# EAGLE design AT24-Timer (EAGLE 8.2.2)
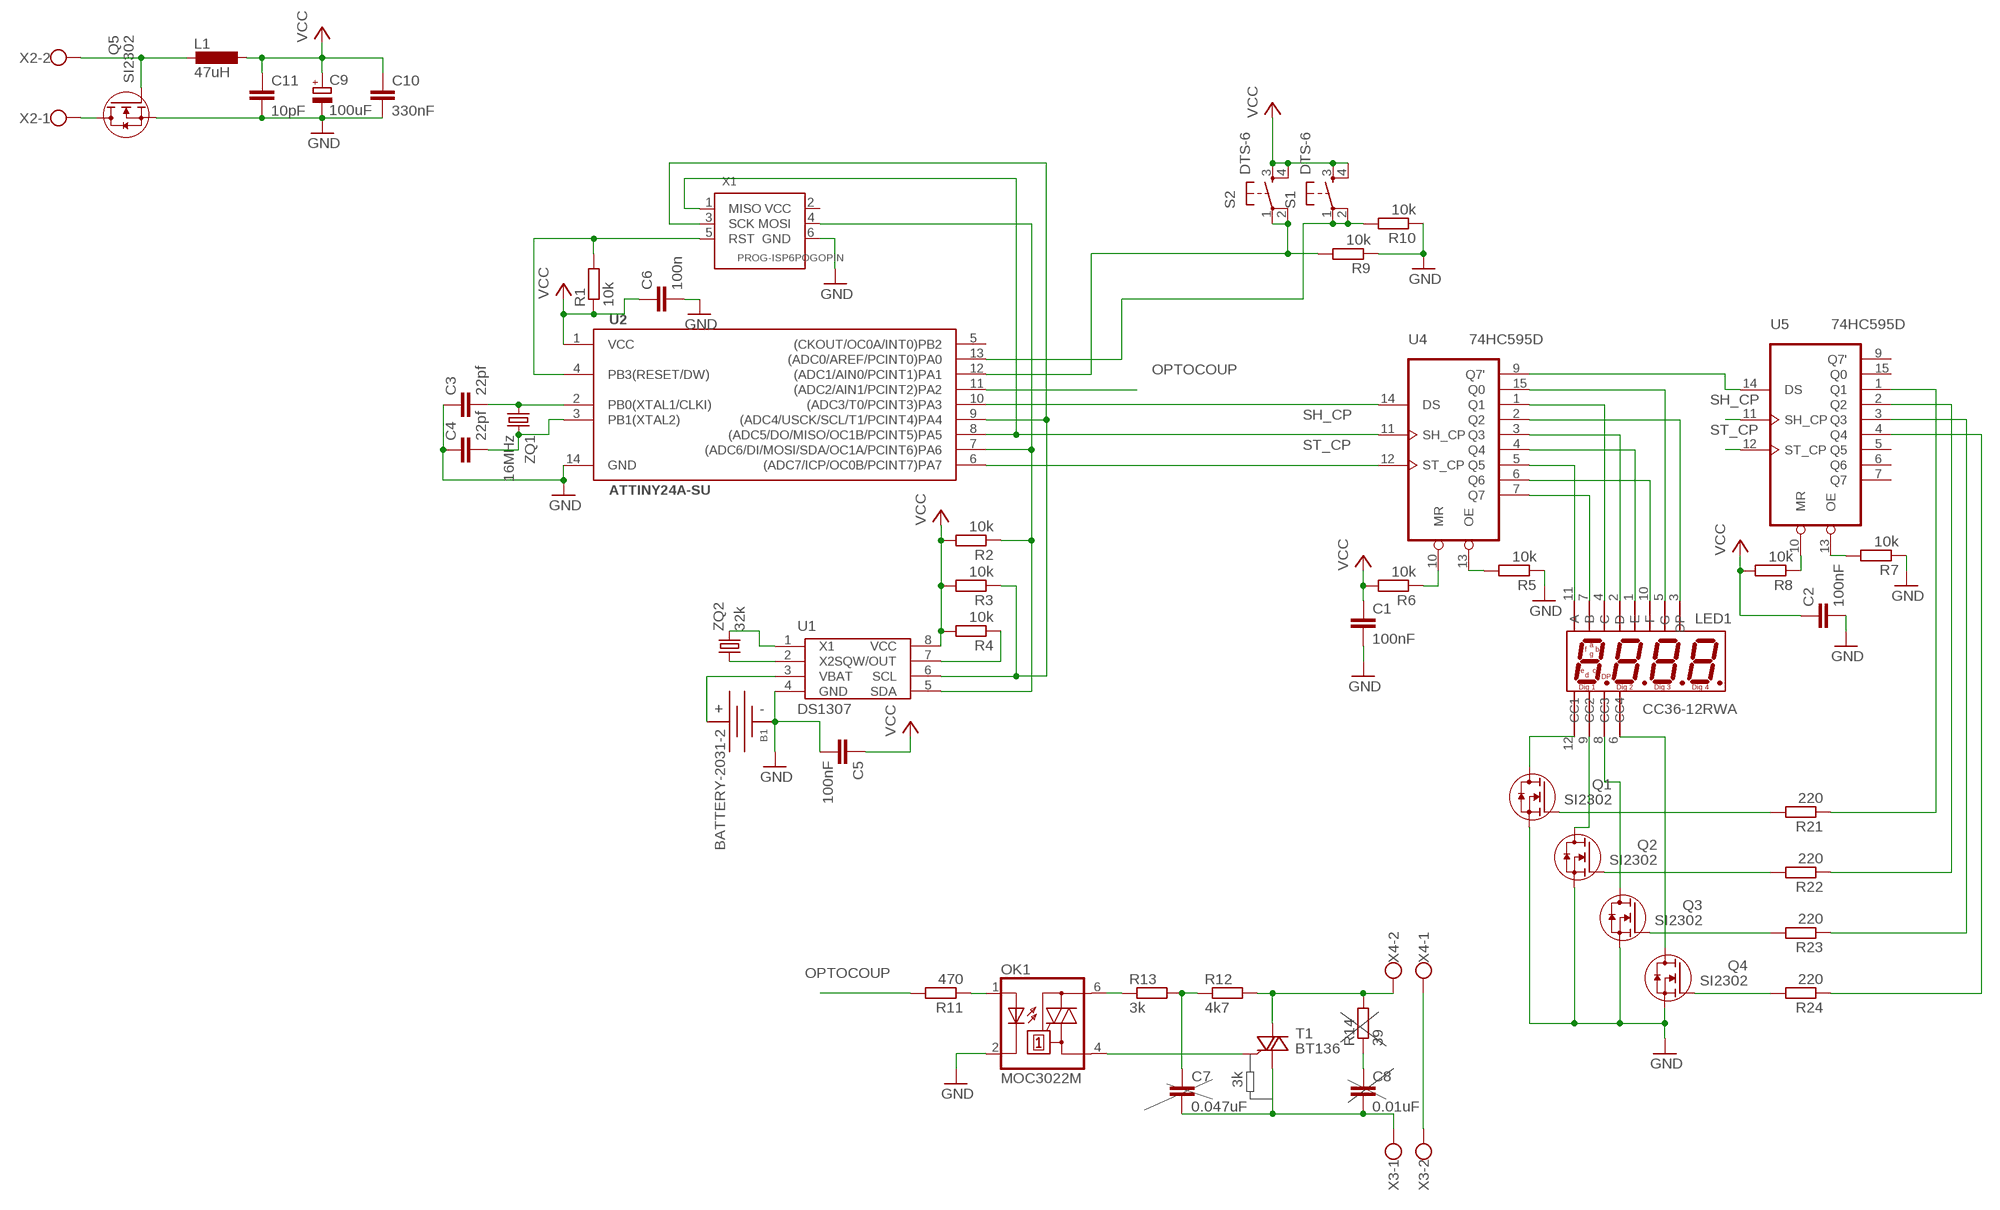
[diagram p0: schematic, sheet 1]

## Parts
B1  BATTERY-2031-2  [BTH2032-2]
C1  100nF  C-EUC0603  [C0603]
C2  100nF  C-EUC0603  [C0603]
C3  22pf  C-EUC0603  [C0603]
C4  22pf  C-EUC0603  [C0603]
C5  100nF  C-EUC0603  [C0603]
C6  100n  C-EUC0603  [C0603]
C7  0.047uF  C-EU150-054X183  [C150-054X183]
C8  0.01uF  C-EU102-043X133  [C102-043X133]
C9  100uF  CPOL-EUE2-5  [E2-5]
C10  330nF  C-EUC0805  [C0805]
C11  10pF  C-EUC0805  [C0805]
L1  47uH  L-EU0204V  [0204V]
LED1  CC36-12RWA  [7SEG_4DIG]
OK1  MOC3022M  [DIL06]
Q1  SI2302  [SOT-23-GSD]
Q2  SI2302  [SOT-23-GSD]
Q3  SI2302  [SOT-23-GSD]
Q4  SI2302  [SOT-23-GSD]
Q5  SI2302  [SOT-23-GSD]
R1  10k  R-EU_R0805  [R0805]
R2  10k  R-EU_R0805  [R0805]
R3  10k  R-EU_R0805  [R0805]
R4  10k  R-EU_R0805  [R0805]
R5  10k  R-EU_R0805  [R0805]
R6  10k  R-EU_R0805  [R0805]
R7  10k  R-EU_R0805  [R0805]
R8  10k  R-EU_R0805  [R0805]
R9  10k  R-EU_R0805  [R0805]
R10  10k  R-EU_R0805  [R0805]
R11  470  R-EU_R0805  [R0805]
R12  4k7  R-EU_0207/7  [0207/7]
R13  3k  R-EU_0207/7  [0207/7]
R14  39  R-EU_0207/7  [0207/7]
R21  220  R-EU_R0805  [R0805]
R22  220  R-EU_R0805  [R0805]
R23  220  R-EU_R0805  [R0805]
R24  220  R-EU_R0805  [R0805]
S1  DTS-6  [DTS-6]
S2  DTS-6  [DTS-6]
T1  BT136  [TO220AB]
U1  DS1307  [SOP08]
U2  ATTINY24A-SU  [SO14]
U4  74HC595D  [SO16]
U5  74HC595D  [SO16]
X1  PROG-ISP6POGOPIN  [PROG_POGOPIN]
X2  W237-102  [W237-102]
X3  W237-102  [W237-102]
X4  W237-102  [W237-102]
ZQ1  16MHz  CRYSTALHC49S  [HC49/S]
ZQ2  32k  CRYSTALTC38H  [TC38H]

## Nets
GND: B1.- C1.2 C2.2 C3.1 C4.1 C5.2 C6.2 C9.- C10.2 C11.2 OK1.2(C) Q1.S Q2.S Q3.S Q4.S Q5.S R5.1 R7.1 R9.1 R10.1 U1.4(GND) U2.14(GND) X1.6(GND)
N$1: X3.2 X4.1
N$2: Q5.D X2.1
N$3: R2.1 U1.5(SDA) U2.7((ADC6/DI/MOSI/SDA/OC1A/PCINT6)PA6) X1.4(MOSI)
N$4: R3.1 U1.6(SCL) U2.9((ADC4/USCK/SCL/T1/PCINT4)PA4) X1.3(SCK)
N$5: R1.2 U2.4(PB3(RESET/DW)) X1.5(RST)
N$6: R10.2 S1.1 S1.2 U2.13((ADC0/AREF/PCINT0)PA0)
N$7: C3.2 U2.2(PB0(XTAL1/CLKI)) ZQ1.1
N$8: C4.2 U2.3(PB1(XTAL2)) ZQ1.2
N$9: R6.1 U4.10(MR)
N$10: R9.2 S2.1 S2.2 U2.12((ADC1/AIN0/PCINT1)PA1)
N$11: U1.2(X2) ZQ2.1
N$12: C8.1 R14.1
N$13: C7.2 C8.2 T1.1(A1) X3.1
N$14: R12.2 R14.2 T1.2(A2) X4.2
N$17: OK1.4(A1) T1.3(G)
N$18: C7.1 R12.1 R13.2
N$19: OK1.6(A2) R13.1
N$20: R5.2 U4.13(OE)
N$21: OK1.1(A) R11.1
N$22: R8.1 U5.10(MR)
N$23: R4.1 U1.7(SQW/OUT)
N$24: U1.1(X1) ZQ2.2
N$25: R7.2 U5.13(OE)
N$26: B1.+ U1.3(VBAT)
N$27: U2.10((ADC3/T0/PCINT3)PA3) U4.14(DS)
N$28: LED1.11(A) U4.5(Q5)
N$29: LED1.7(B) U4.7(Q7)
N$30: U4.9(Q7') U5.14(DS)
N$31: LED1.4(C) U4.1(Q1)
N$32: LED1.2(D) U4.3(Q3)
N$33: LED1.1(E) U4.4(Q4)
N$34: LED1.10(F) U4.6(Q6)
N$35: LED1.5(G) U4.15(Q0)
N$36: LED1.3(DP) U4.2(Q2)
N$37: LED1.12(CC1) Q1.D
N$38: LED1.9(CC2) Q2.D
N$39: LED1.8(CC3) Q3.D
N$40: LED1.6(CC4) Q4.D
N$41: R21.1 U5.1(Q1)
N$42: R22.1 U5.2(Q2)
N$43: R23.1 U5.3(Q3)
N$44: R24.1 U5.4(Q4)
N$49: L1.2 Q5.G X2.2
N$65: Q4.G R24.2
N$66: Q3.G R23.2
N$67: Q2.G R22.2
N$68: Q1.G R21.2
OPTOCOUP: R11.2 U2.11((ADC2/AIN1/PCINT2)PA2)
SH_CP: U2.8((ADC5/DO/MISO/OC1B/PCINT5)PA5) U4.11(SH_CP) U5.11(SH_CP) X1.1(MISO)
ST_CP: U2.6((ADC7/ICP/OC0B/PCINT7)PA7) U4.12(ST_CP) U5.12(ST_CP)
VCC: C1.1 C2.1 C5.1 C6.1 C9.+ C10.1 C11.1 L1.1 R1.1 R2.2 R3.2 R4.2 R6.2 R8.2 S1.3 S1.4 S2.3 S2.4 U1.8(VCC) U2.1(VCC)
Unconnected: U2.5((CKOUT/OC0A/INT0)PB2) U5.5(Q5) U5.6(Q6) U5.7(Q7) U5.9(Q7') U5.15(Q0) X1.2(VCC)

## Notes on the sheet
- 3k

## Power pins joined to a net without a drawn wire
GND: U4.8(GND) U5.8(GND)
VCC: U4.16(VCC) U5.16(VCC)

## Library data of the parts
B1 = usb:BATTERY
C1-C8 C10 C11 = rcl:C-EU: CAPACITOR, European symbol
C9 = rcl:CPOL-EU: POLARIZED CAPACITOR, European symbol
L1 = rcl:L-EU: INDUCTOR, European symbol
LED1 = usb:CC36-12RWA: 7 Segment 4 Digit 0.36inch Common Catode
OK1 = optocoupler:MOC30*M: RANDOM-PHASE OPTOISOLATORS TRIAC DRIVER OUTPUT Source: http://www.fairchildsemi.com MOC3020-M.pdf; MF: FAIRCHILD SEMICONDUCTOR; MPN: MOC3022-M; OC_FARNELL: 1021086; OC_NEWARK: 58K1956
Q1-Q5 = usb:SI2302: N-канальный полевик
R1-R14 R21-R24 = rcl:R-EU_: RESISTOR, European symbol
S1 S2 = switch-tact:DTS-6
T1 = triac:BT136: Triac BT136 series E sensitive gate Source: http://www.nxp.com/acrobat_download/datasheets/BT136_SERIES_E_2.pdf
U1 = usb:DS1307: Real-Time Clock DS1307
U2 = usb:ATTINY24A: ATTiny24A ATTiny44A ATTiny84A
U4 U5 = 74xx-eu:74*595: 8-bit SHIFT REGISTER, output latch
X1 = usb:PROG-ISP
X2-X4 = con-wago-500:W237-102: WAGO SCREW CLAMP; MPN: 237-102; OC_FARNELL: unknown; OC_NEWARK: 70K9898
ZQ1 = crystal:CRYSTAL: CRYSTAL; OC_FARNELL: 1667008; OC_NEWARK: unknown
ZQ2 = crystal:CRYSTAL: CRYSTAL; OC_FARNELL: unknown; OC_NEWARK: unknown

## Board
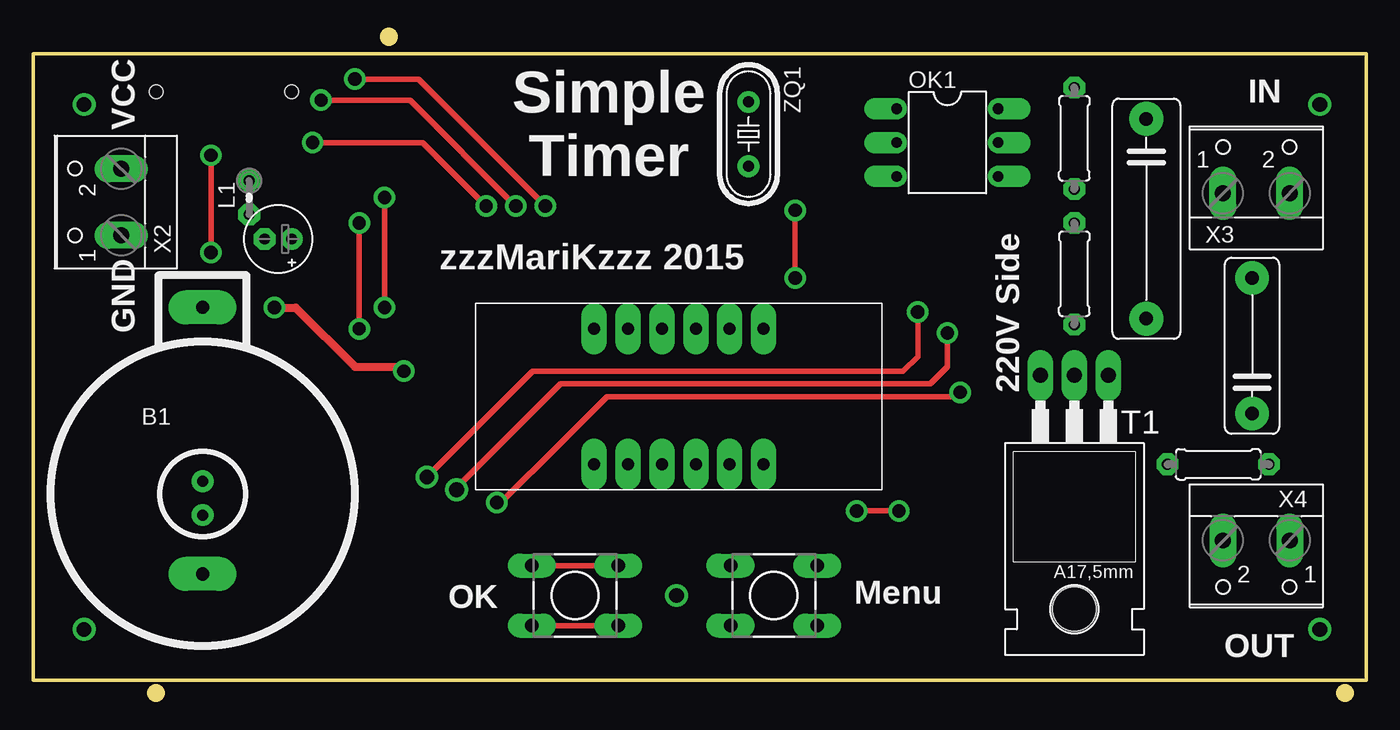
[diagram p1: board, top side]
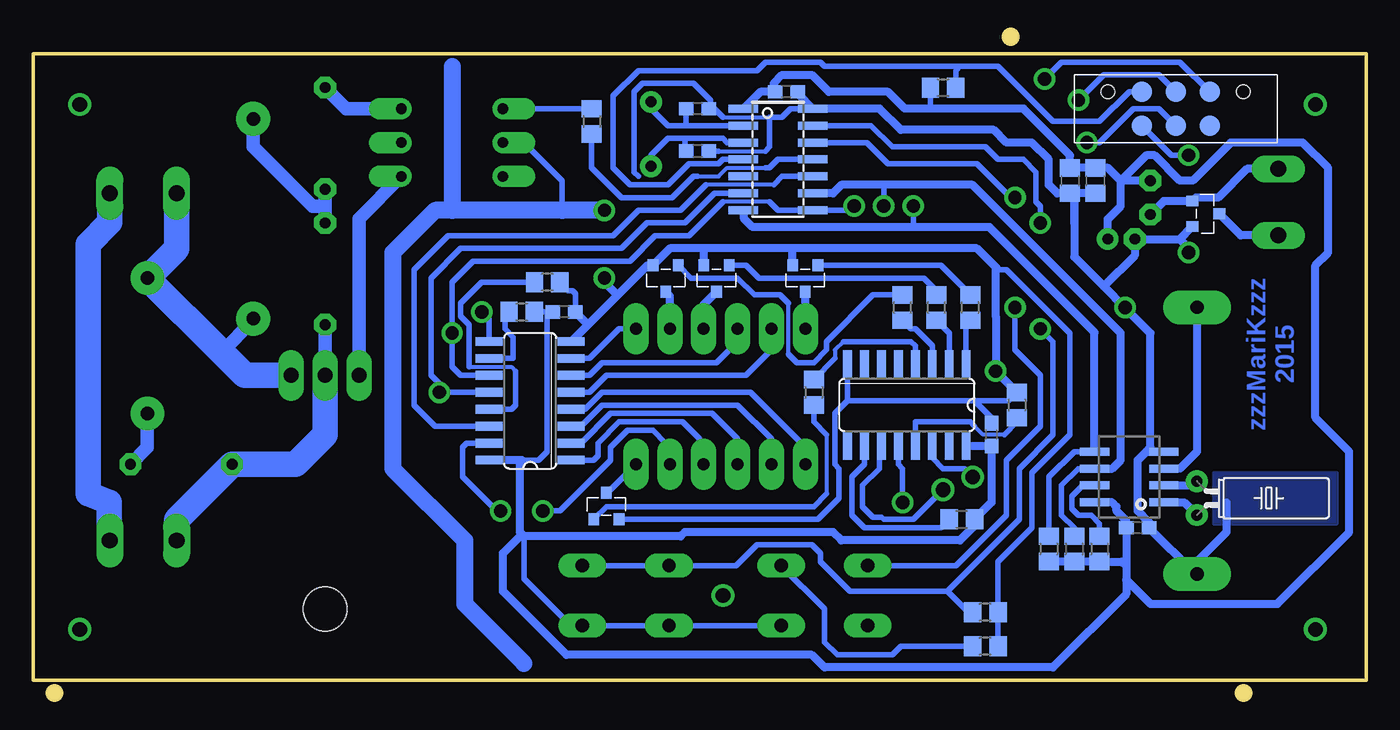
[diagram p2: board, bottom side, seen from below]

Size 100 x 49.72 mm. Coordinates in mm from the lower left corner, seen from the top.
Outline: 0,1.21 100,1.21 100,48.21 0,48.21 0,1.21
Outline: circle at 26.67,49.47 radius 0.25
Outline: circle at 9.21,0.25 radius 0.25
Outline: circle at 98.42,0.25 radius 0.25
Copper layers (1*16): Top 0.035mm / dielectric 1.5mm / Bottom 0.035mm
Design rules "default *": minimum track width 12mil, minimum drill 20mil, track to track 12mil, track to pad 12mil, pad to pad 12mil, via to via 12mil, smd to smd 8mil, copper to edge 20mil, drill to drill 8mil, minimum pad ring 16mil, minimum via ring 12mil, stop-mask expansion 4mil, vias tented up to drill 0mil, thermal gap 20mil
Holes 0.6 mm at 26.67,49.47 9.21,0.25 98.42,0.25

### Footprints (pad centres in the part's own frame; a part is rotated, then mirrored left to right if it is on the bottom)
BTH2032-2 = drill 1 pad 2.54 long: + 0,-14; - 0,6
C0603 = smd 1.1 x 1: 1 -0.85,0; 2 0.85,0
C150-054X183 = drill 1.016 pad 2.54: 1 -7.493,0; 2 7.493,0
C102-043X133 = drill 1.016 pad 2.54: 1 -5.08,0; 2 5.08,0
E2-5 = drill 0.813 pad 1.27: + -1.016,0 | drill 0.813 pad 1.27 octagon: - 1.016,0
C0805 = smd 1.3 x 1.5: 1 -0.95,0; 2 0.95,0
0204V = drill 0.813 octagon: 1 -1.27,0; 2 1.27,0
7SEG_4DIG = drill 0.9 pad 1.93 long: 1 -6.35,-5.08; 2 -3.81,-5.08; 3 -1.27,-5.08; 4 1.27,-5.08; 5 3.81,-5.08; 6 6.35,-5.08; 7 6.35,5.08; 8 3.81,5.08; 9 1.27,5.08; 10 -1.27,5.08; 11 -3.81,5.08; 12 -6.35,5.08
DIL06 = drill 0.813 offset: 1 -2.54,-3.81; 2 0,-3.81; 3 2.54,-3.81; 4 2.54,3.81; 5 0,3.81; 6 -2.54,3.81
SOT-23-GSD = smd 0.8 x 0.9: D 0,2; G -0.95,0; S 0.95,0
R0805 = smd 1.3 x 1.5: 1 -0.95,0; 2 0.95,0
0207/7 = drill 0.813 octagon: 1 -3.81,0; 2 3.81,0
DTS-6 = drill 1 long: 1 -3.25,2.25; 2 3.25,2.25; 3 -3.25,-2.25; 4 3.25,-2.25
TO220AB = drill 1.118 long: 1 -2.54,-6.35; 2 0,-6.35; 3 2.54,-6.35 | hole 3.302: 0,11.176
SOP08 = smd 0.6 x 2.2: 1 -1.905,-2.6; 2 -0.635,-2.6; 3 0.635,-2.6; 4 1.905,-2.6; 5 1.905,2.6; 6 0.635,2.6; 7 -0.635,2.6; 8 -1.905,2.6
SO14 = smd 0.6 x 2.2: 1 -3.81,-2.6; 2 -2.54,-2.6; 3 -1.27,-2.6; 4 0,-2.6; 5 1.27,-2.6; 6 2.54,-2.6; 7 3.81,-2.6; 8 3.81,2.6; 9 2.54,2.6; 10 1.27,2.6; 11 0,2.6; 12 -1.27,2.6; 13 -2.54,2.6; 14 -3.81,2.6
SO16 = smd 0.66 x 2.032: 1 -4.445,-3.073; 2 -3.175,-3.073; 3 -1.905,-3.073; 4 -0.635,-3.073; 5 0.635,-3.073; 6 1.905,-3.073; 7 3.175,-3.073; 8 4.445,-3.073; 9 4.445,3.073; 10 3.175,3.073; 11 1.905,3.073; 12 0.635,3.073; 13 -0.635,3.073; 14 -1.905,3.073; 15 -3.175,3.073; 16 -4.445,3.073
PROG_POGOPIN = smd 1.524 x 1.524: 1 0,7.62; 2 2.54,7.62; 3 0,5.08; 4 2.54,5.08; 5 0,2.54; 6 2.54,2.54 | hole 1.016: 0,0; 0,10.16
W237-102 = drill 1.194 long: 1 -2.5,-1.27; 2 2.5,-1.27
HC49/S = drill 0.813: 1 -2.413,0; 2 2.413,0
TC38H = drill 0.813: 1 -1.27,0; 2 1.27,0

### Placement (x,y rotation side)
B1  12.7,15.18 180 top
C1  28.11,19.62 90 bottom
C2  60.18,28.83 0 bottom
C3  50.16,44.07 180 bottom
C4  50.16,40.89 180 bottom
C5  17.14,12.64 0 bottom
C6  43.5,45.34 0 bottom
C7  83.5,35.81 270 top
C8  91.44,26.29 90 top
C9  18.38,34.29 180 top
C10  22.23,38.67 270 bottom
C11  20.32,38.67 270 bottom
L1  16.19,37.4 270 top
LED1  48.43,22.48 0 top
OK1  68.58,41.53 270 top
Q1  42.08,32.32 180 bottom
Q2  48.75,32.32 180 bottom
Q3  52.56,32.32 180 bottom
Q4  57.01,13.27 0 bottom
Q5  13.03,36.19 270 bottom
R1  31.75,45.66 0 bottom
R2  23.81,11.05 270 bottom
R3  21.91,11.05 270 bottom
R4  20,11.05 270 bottom
R5  61.45,31.05 180 bottom
R6  63.35,28.83 0 bottom
R7  26.21,21.84 270 bottom
R8  30.34,13.27 0 bottom
R9  28.57,3.75 180 bottom
R10  28.57,6.29 180 bottom
R11  58.1,43.12 270 bottom
R12  78.11,31.69 270 top
R13  78.11,41.85 270 top
R14  88.9,17.4 180 top
R21  29.7,29.15 90 bottom
R22  32.24,29.15 90 bottom
R23  34.78,29.15 90 bottom
R24  41.45,22.8 270 bottom
S1  55.56,7.56 0 top
S2  40.64,7.56 0 top
T1  78.11,17.72 180 top
U1  17.78,16.45 90 bottom
U2  44.13,40.26 270 bottom
U4  62.72,22.16 90 bottom
U5  34.46,21.84 180 bottom
X1  19.37,45.34 270 bottom
X2  5.33,37.06 90 top
X3  91.76,38.99 0 top
X4  91.76,10.41 180 top
ZQ1  53.66,42.16 270 top
ZQ2  12.7,14.86 270 bottom

### Tracks (layer width: path | path; a pad name or v marks a point on that pad's centre or on a via)
GND  (via drill 1)
  Top 0.406: v13.34,40.58 v13.34,33.27 | v57.15,36.45 v57.15,31.37
  Top 0.61: v18.1,29.15 19.68,29.15 24.13,24.7 27.48,24.7 v27.8,24.38
  Bottom 0.305: 48.26,43.43 44.77,43.43 | 48.58,40.89 45.09,40.89
  Bottom 0.406: U5.8 38.91,22.16 | 38.91,22.16 39.86,21.21 39.86,17.4 39.54,17.08 39.54,14.86 41.13,13.27 Q4.S | 59.55,28.83 C2.2 59.33,30.2 59.55,30.42 59.87,30.42 R5.1 | C1.2 28.11,20.89 29.38,22.16 | 29.38,22.16 38.91,22.16 | R7.1 26.84,22.16 29.38,22.16 | C3.1 48.9,44.07 48.26,43.43 | U2.14 43.18,44.07 43.81,43.43 44.77,43.43 44.77,41.21 45.09,40.89 | C4.1 48.58,40.89 | R9.1 R10.1 27.62,10.09 25.08,12.64 25.08,16.76 22.23,19.62 22.23,27.24 26.99,32 27.48,32 27.8,32.32 27.8,28.51 | X1.6 14.61,40.58 v13.34,40.58 | OK1.2 63.18,41.53 60.33,38.67 60.33,36.45
  Bottom 0.61: R7.1 v27.8,24.38 27.8,28.51 27.8,32.18 29.21,33.59 43.18,33.59 | 16.51,18.35 17.14,17.72 17.14,13.91 16.3,13.06 C5.2 12.84,9.18 B1.- 12.7,10.1 10.48,12.32 10.48,14.54 | 16.51,18.35 U1.4 | C6.2 42.65,45.18 U2.14 36.51,44.07 34.92,42.48 27.94,42.48 26.99,41.53 25.08,41.53 23.81,40.26 23.81,38.35 23.18,37.72 C10.2 | 43.18,33.59 49.85,33.59 | 49.85,33.59 52.24,33.59 Q3.S 53.93,32.32 56.18,30.08 | Q1.S 43.03,33.44 43.18,33.59 | 16.51,18.35 16.19,18.67 16.19,27.24 v18.1,29.15 19.68,30.73 | Q2.S 49.7,33.44 49.85,33.59 | 56.18,30.08 58.4,27.85 | 58.4,27.85 U4.8 | 59.55,28.83 59.37,28.83 58.4,27.85 | v57.15,31.37 57.15,31.05 56.18,30.08 | 21.91,35.5 21.91,37.4 C10.2 | C10.2 C11.2 21.91,37.72 21.91,32.96 19.68,30.73 | 19.68,30.73 17.36,33.06 C9.- 13.98,34.29 | 13.98,34.29 Q5.S | v13.34,33.27 13.34,33.65 13.98,34.29
  Bottom 1.27: v57.15,36.45 60.33,36.45 68.58,36.45 | 68.58,36.45 69.85,36.45 73.03,33.27 73.03,17.08 67.63,11.68 67.63,6.92 63.18,2.48 | 68.58,47.24 68.58,36.45
  pour Bottom: 2.22,16.76 2.22,12.95 11.43,12.95 11.43,16.76
N$1
  Bottom 0.406: 94.3,12.04 94.3,11.72 X4.1
  Bottom 1.93: X3.2 94.26,35.54 95.89,33.91 95.89,15.18 94.3,14.54 94.3,12.04
N$2
  Bottom 0.61: X2.1 9.41,34.56 Q5.D
N$3  (via drill 1)
  Top 0.406: v20.95,41.53 29.21,41.53 v33.97,36.77
  Bottom 0.406: R2.1 23.81,16.45 21.91,18.35 U1.5 | X1.4 15.56,44.07 17.46,44.07 20,41.53 v20.95,41.53 | v33.97,36.77 33.97,35.18
  Bottom 0.61: U1.5 20.38,27.3 28.26,35.18 33.97,35.18 46.04,35.18 46.67,35.81 46.67,36.39 U2.7
N$4  (via drill 1)
  Top 0.406: v21.59,44.7 28.26,44.7 v36.2,36.77
  Bottom 0.406: R3.1 21.91,12.64 22.86,13.59 22.86,15.81 21.59,17.08 U1.6 | X1.3 15.56,46.61 19.68,46.61 v21.59,44.7 | v36.2,36.77 36.2,38.35
  Bottom 0.61: U1.6 19.05,17.08 18.41,17.72 18.41,27.24 29.53,38.35 36.2,38.35 39.37,38.35 40.01,37.72 U2.9
N$5
  Bottom 0.406: U2.4 48.26,40.26 48.58,39.94 50.8,39.94 52.39,38.35 55.24,38.35 56.52,39.62 56.52,45.02 54.61,46.93 45.72,46.93 45.09,47.56 40.96,47.56 40.64,47.24 30.48,47.24 | 30.48,47.24 27.62,47.24 23.5,43.12 20,43.12 17.78,45.34 X1.5 | R1.2 30.8,46.92 30.48,47.24
N$6  (via drill 1)
  Top 0.406: v24.45,35.5 v24.45,27.56
  Bottom 0.406: 31.43,7.87 38.73,7.87 40.96,10.1 40.96,10.73 41.59,11.37 45.72,11.37 47.28,9.81 S1.1 S1.2 | 31.43,7.87 26.04,13.27 26.04,17.08 23.5,19.62 23.5,26.61 v24.45,27.56 | R10.2 29.84,6.29 31.43,7.87 | U2.13 37.15,42.8 35.56,41.21 28.57,41.21 27.62,40.26 25.72,40.26 24.77,39.31 24.77,37.08 24.45,36.77 v24.45,35.5
N$7
  Bottom 0.406: ZQ1.1 53.66,44.07 52.39,42.8 51.12,42.8 | 51.12,42.8 U2.2 | C3.2 51.02,42.9 51.12,42.8
N$8
  Bottom 0.406: ZQ1.2 53.66,40.58 52.39,41.85 51.12,41.85 | 51.12,41.85 48.26,41.85 47.94,41.53 U2.3 | C4.2 51.12,40.89 51.12,41.85
N$9
  Bottom 0.406: U4.10 63.99,25.34 63.99,26.92 64.62,27.56 64.62,28.83 R6.1
N$10  (via drill 1)
  Top 0.406: S2.1 S2.2 | v26.35,37.4 v26.35,29.15
  Bottom 0.406: S2.1 30.77,9.81 26.99,13.59 26.99,17.72 24.45,20.26 24.45,24.07 26.35,25.97 v26.35,29.15 | R9.2 34.92,3.75 35.56,3.11 39.69,3.11 40.64,4.06 40.64,6.56 S2.2 | v26.35,37.4 26.67,37.4 29.21,39.94 35.88,39.94 37.47,41.53 U2.12
N$11
  Bottom 0.61: U1.2 13.02,15.81 ZQ2.1
N$12
  Bottom 1.016: C8.1 91.44,18.67 R14.1
N$13
  Bottom 1.016: C7.2 83.5,28.19 85.88,25.81
  Bottom 1.93: T1.1 84.14,24.07 85.88,25.81 C8.2 89.26,33.55 X3.1
N$14
  Bottom 1.016: R12.2 T1.2
  Bottom 1.93: T1.2 78.11,19.62 80.33,17.4 R14.2 89.26,13.23 X4.2
N$15  (via drill 1.1)
  other vias: 3.81,44.39
N$16  (via drill 1.1)
  other vias: 3.81,5.02
N$17
  Bottom 1.016: OK1.4 75.56,35.81 T1.3
N$18
  Bottom 1.016: R12.1 78.11,36.45 | 78.11,36.45 R13.2 | C7.1 83.5,41.21 79.06,36.77 78.42,36.77 78.11,36.45
N$19
  Bottom 1.016: OK1.6 76.52,44.07 R13.1
N$20
  Bottom 0.305: 67.31,24.7 64.14,24.7 63.82,24.38
  Bottom 0.406: R5.2 66.36,31.05 67.94,29.46 67.94,28.51 67.31,27.88 67.31,24.7 | 63.82,24.38 63.82,21.84 64.14,21.53 U4.13
N$21
  Bottom 0.406: OK1.1 R11.1
N$22
  Bottom 0.406: U5.10 37.64,17.4 38.59,16.45 38.59,13.59 37.64,12.64 31.92,12.64 R8.1
N$23
  Bottom 0.406: U1.7 21.27,15.81 22.07,15.02 22.07,14.07 21.59,13.59 20.64,13.59 20,12.95 R4.1
N$24
  Bottom 0.61: U1.1 13.65,14.54 ZQ2.2
N$25
  Bottom 0.305: 27.16,19.62 28.75,19.62 29.38,20.26
  Bottom 0.406: 29.38,20.26 29.7,20.57 33.83,20.57 U5.13 | 27.16,19.62 26.21,20.57 R7.2
N$26
  Bottom 0.61: B1.+ 12.7,18.35 13.97,17.08 U1.3
N$27
  Bottom 0.305: 44.45,38.35 49.53,38.35
  Bottom 0.406: U2.10 43.81,38.99 44.45,38.35 | 49.53,38.35 51.44,36.45 54.61,36.45 56.52,34.54 68.9,34.54 71.44,32 71.44,21.84 69.85,20.26 U4.14
N$28
  Bottom 0.406: U4.5 58.27,22.8 57.01,24.07 46.53,24.07 44.62,25.97 LED1.11
N$29
  Bottom 0.406: U4.7 58.27,25.34 56.05,27.56 LED1.7
N$30  (via drill 1, 1.1)
  Top 0.406: v66.36,28.83 66.36,25.48 65.26,24.38 37.47,24.38 v29.53,16.45
  Bottom 0.406: U4.9 65.79,28.26 v66.36,28.83 | U5.14 32.56,17.89 31.75,17.08 30.16,17.08 v29.53,16.45
N$31
  Bottom 0.406: U4.1 57.96,17.72 57.64,18.03 57.64,18.99 56.05,20.57 51.29,20.57 50.02,19.3 50.02,17.72 LED1.4
N$32
  Bottom 0.406: U4.3 58.91,20.26 57.32,21.84 47.16,21.84 44.62,19.3 LED1.2
N$33
  Bottom 0.406: U4.4 58.59,21.53 57.32,22.8 46.21,22.8 42.08,18.67 LED1.1
N$34
  Bottom 0.406: U4.6 58.27,24.07 57.32,25.02 48.75,25.02 47.16,26.61 LED1.10
N$35  (via drill 1)
  Top 0.406: v61.77,13.91 v64.94,13.91
  Bottom 0.406: LED1.5 52.56,17.72 52.56,18.99 53.51,19.94 55.42,19.94 56.69,18.67 56.69,17.72 60.5,13.91 v61.77,13.91 | U4.15 67.48,18.99 67.8,18.67 67.8,16.45 65.26,13.91 v64.94,13.91
N$36
  Bottom 0.406: U4.2 58.91,18.99 56.69,21.21 49.07,21.21 47.16,19.3 LED1.3
N$37
  Bottom 0.61: LED1.12 Q1.D
N$38
  Bottom 0.61: LED1.9 49.7,29.37 Q2.D
N$39
  Bottom 0.61: LED1.8 52.24,30 Q3.D
N$40
  Bottom 0.406: Q4.D 56.91,15.27 LED1.6
N$41
  Bottom 0.406: U5.1 30.02,27.88 R21.1
N$42
  Bottom 0.406: U5.2 31.29,27.24 R22.1
N$43
  Bottom 0.406: U5.3 32.56,26.29 33.83,27.56 34.14,27.56 R23.1
N$44
  Bottom 0.305: 39.23,26.61 39.86,25.97 39.86,25.33
  Bottom 0.406: U5.4 33.83,26.29 34.15,26.61 39.23,26.61 | 39.86,25.33 R24.1
N$45  (via drill 1.1)
  other vias: 96.52,44.39
N$46  (via drill 1.1)
  other vias: 96.52,5.02
N$47  (via drill 1.1)
  other vias: 48.26,7.56
N$48
  Bottom 0.406: 49.21,44.39 49.21,44.7 50.48,45.97 54.29,45.97 54.93,45.34 54.93,39.31 54.61,38.99
N$49
  Bottom 0.61: X2.2 8.95,39.56 11.11,37.4 12.77,37.4 Q5.G 15.19,37.14 L1.2
N$65
  Bottom 0.305: 40.49,19.62 40.49,15.18
  Bottom 0.406: R24.2 41.45,20.57 40.49,19.62 | 40.49,15.18 41.45,14.22 57.01,14.22 Q4.G
N$66
  Bottom 0.305: 43.35,25.65 43.35,29.46
  Bottom 0.406: R23.2 37.01,30.1 40.49,26.61 40.49,25.97 41.45,25.02 42.72,25.02 43.35,25.65 | 43.35,29.46 43.99,30.1 45.89,30.1 47.16,31.37 50.66,31.37 Q3.G
N$67
  Bottom 0.406: R22.2 32.24,30.42 33.19,31.37 45.58,31.37 46.53,32.32 Q2.G
N$68
  Bottom 0.406: R21.2 31.92,32.32 Q1.G
OPTOCOUP
  Bottom 0.305: 50.16,38.99 48.58,38.99 47.94,39.62 45.09,39.62
  Bottom 0.406: R11.2 58.1,39.62 55.88,37.4 52.07,37.4 50.48,38.99 50.16,38.99 | 45.09,39.62 44.77,39.62 44.13,40.26 U2.11
SH_CP  (via drill 1, 1.1)
  Top 0.406: v24.13,46.29 28.89,46.29 v38.42,36.77 | v31.75,15.49 31.75,15.64 39.54,23.43 67.31,23.43 68.58,24.7 v68.58,27.24
  Bottom 0.305: 44.77,37.08 48.26,37.08
  Bottom 0.406: U4.11 67.94,24.07 68.58,24.7 v68.58,27.24 68.58,31.05 66.99,32.64 55.24,32.64 53.34,34.54 50.8,34.54 48.26,37.08 | 44.77,37.08 44.13,36.45 U2.8 38.42,36.45 v38.42,36.77 | X1.1 13.97,47.56 22.86,47.56 v24.13,46.29 | v31.75,15.49 33.97,13.27 36.2,13.27 36.37,13.44 37,13.44 37.78,14.22 37.78,15.81 36.51,17.08 36.51,18.63 U5.11
ST_CP  (via drill 1)
  Top 0.406: v69.53,22.8 69.22,22.48 43.03,22.48 39.77,19.22 39.54,18.99 35.1,14.54 v34.78,14.54
  Bottom 0.406: U5.12 35.1,17.4 34.78,17.08 v34.78,14.54 | U4.12 v69.53,22.8 69.53,23.43 70.17,24.07 70.17,31.37 67.94,33.59 55.88,33.59 53.98,35.5 51.12,35.5 48.9,37.72 U2.6
VCC
  Top 0.406: S2.3 S2.4
  Bottom 0.406: 63.35,17.72 62.09,17.72 61.45,18.35 61.45,28.83 C2.1 R6.2 | U5.16 C1.1 | S2.4 S1.3 S1.4 59.66,5.31 63.18,8.83 63.18,12 | R1.1 32.7,44.07 | R4.2 21.59,10.1
  Bottom 0.61: 63.35,17.72 63.5,17.72 | 63.5,17.72 U4.16 | U5.16 28.21,18.77 28.11,18.67 | U1.8 19.05,14.54 18.73,14.22 18.73,13.91 18,13.17 C5.1 18,9.78 | U2.1 45.46,45.34 C6.1 44.45,45.44 44.45,45.97 43.81,46.61 41.59,46.61 40.32,45.34 35.88,45.34 34.61,44.07 32.7,44.07 25.72,44.07 22.23,40.58 C10.1 C11.1 19.37,39.62 18.41,38.67 | R2.2 R3.2 R4.2 18.32,10.1 18,9.78 | 18,9.78 18,8.72 | 18,8.72 16.19,6.92 6.67,6.92 1.27,12.32 1.27,18.35 3.81,20.89 3.81,32.32 2.86,33.27 2.86,39.62 4.76,41.53 10.16,41.53 13.02,38.67 13.97,38.67 15.88,40.58 16.51,40.58 18.41,38.67 | 18,8.72 18,7.66 23.5,2.16 40.64,2.16 41.59,3.11 60.01,3.11 64.77,7.87 64.77,10.73 63.5,12 63.18,12 | C1.1 28.11,14.54 R8.2 29.53,13.13 29.53,12.64 30.48,11.68 39.37,11.68 40.01,12.32 51.12,12.32 51.44,12 63.18,12 | 63.18,12 63.5,12.32 63.5,17.72 | C9.+ 19.39,35.79 18.41,36.77 18.41,38.67 | L1.1 18.41,38.67

### Text on the board
Bottom: zzzMariKzzz / 2015
tNames: IN | VCC | Simple / Timer | zzzMariKzzz 2015 | GND | 220V Side | Menu | OK | OUT